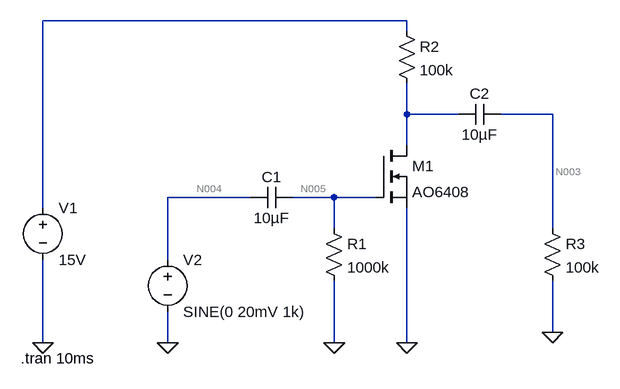
[diagram p0: schematic mosfet-amplificador.asc]
mosfet-amplificador.asc, the LTspice schematic file:
Version 4
SHEET 1 880 680
WIRE 496 -176 -64 -176
WIRE 496 -160 496 -176
WIRE 496 -32 496 -80
WIRE 576 -32 496 -32
WIRE 720 -32 640 -32
WIRE 496 16 496 -32
WIRE 256 96 128 96
WIRE 384 96 320 96
WIRE 448 96 384 96
WIRE -64 112 -64 -176
WIRE 384 144 384 96
WIRE 720 144 720 -32
WIRE 128 192 128 96
WIRE 720 304 720 224
WIRE -64 320 -64 192
WIRE 128 320 128 272
WIRE 384 320 384 224
WIRE 496 320 496 112
FLAG -64 320 0
FLAG 128 320 0
FLAG 384 320 0
FLAG 496 320 0
FLAG 720 304 0
SYMBOL voltage -64 96 R0
WINDOW 123 0 0 Left 0
WINDOW 39 0 0 Left 0
SYMATTR InstName V1
SYMATTR Value 15V
SYMBOL voltage 128 176 R0
WINDOW 123 0 0 Left 0
WINDOW 39 0 0 Left 0
SYMATTR InstName V2
SYMATTR Value SINE(0 20mV 1k)
SYMBOL cap 320 80 R90
WINDOW 0 0 32 VBottom 2
WINDOW 3 32 32 VTop 2
SYMATTR InstName C1
SYMATTR Value 10µF
SYMBOL cap 640 -48 R90
WINDOW 0 0 32 VBottom 2
WINDOW 3 32 32 VTop 2
SYMATTR InstName C2
SYMATTR Value 10µF
SYMBOL res 368 128 R0
SYMATTR InstName R1
SYMATTR Value 1000k
SYMBOL res 480 -176 R0
SYMATTR InstName R2
SYMATTR Value 100k
SYMBOL nmos 448 16 R0
SYMATTR InstName M1
SYMATTR Value AO6408
SYMBOL res 704 128 R0
SYMATTR InstName R3
SYMATTR Value 100k
TEXT -98 344 Left 2 !.tran 10ms

The netlist it stands for:
* mosfet-amplificador.asc
V1 N001 0 15V
V2 N004 0 SINE(0 20mV 1k)
C1 N005 N004 10µF
C2 N003 N002 10µF
R1 N005 0 1000k
R2 N001 N002 100k
M1 N002 N005 0 0 AO6408
R3 N003 0 100k
.model NMOS NMOS
.model PMOS PMOS
.lib standard.mos
.tran 10ms
.backanno
.end

* Results of the author's LTspice run, read from the files saved beside the schematic
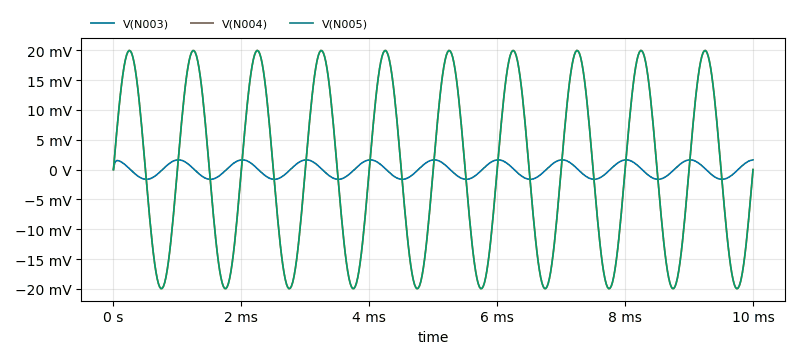
[diagram p1: Transient Analysis of mosfet-amplificador.asc, plotted from the saved traces]
* Transient Analysis, 1 run:
*   V(N003): min -1.632 mV, max 1.632 mV, average -4.841 µV, rms 1.151 mV, last 1.626 mV
*   V(N004): min -20 mV, max 20 mV, average 58.3 nV, rms 14.15 mV, last 0 V
*   V(N005): min -19.97 mV, max 19.97 mV, average -259.3 nV, rms 14.14 mV, last 42.93 nV